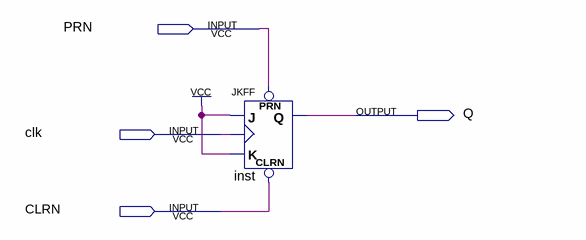
[diagram p0: schematic sheet]
// Quartus schematic Block1.bdf as structural Verilog: 1 symbols, 4 pins
module Block1 (
  input  PRN,
  input  clk,
  input  CLRN,
  output Q
);

  JKFF inst (.PRN(PRN), .CLRN(CLRN), .K(1'b1), .J(1'b1), .CLK(clk), .Q(Q));
endmodule
